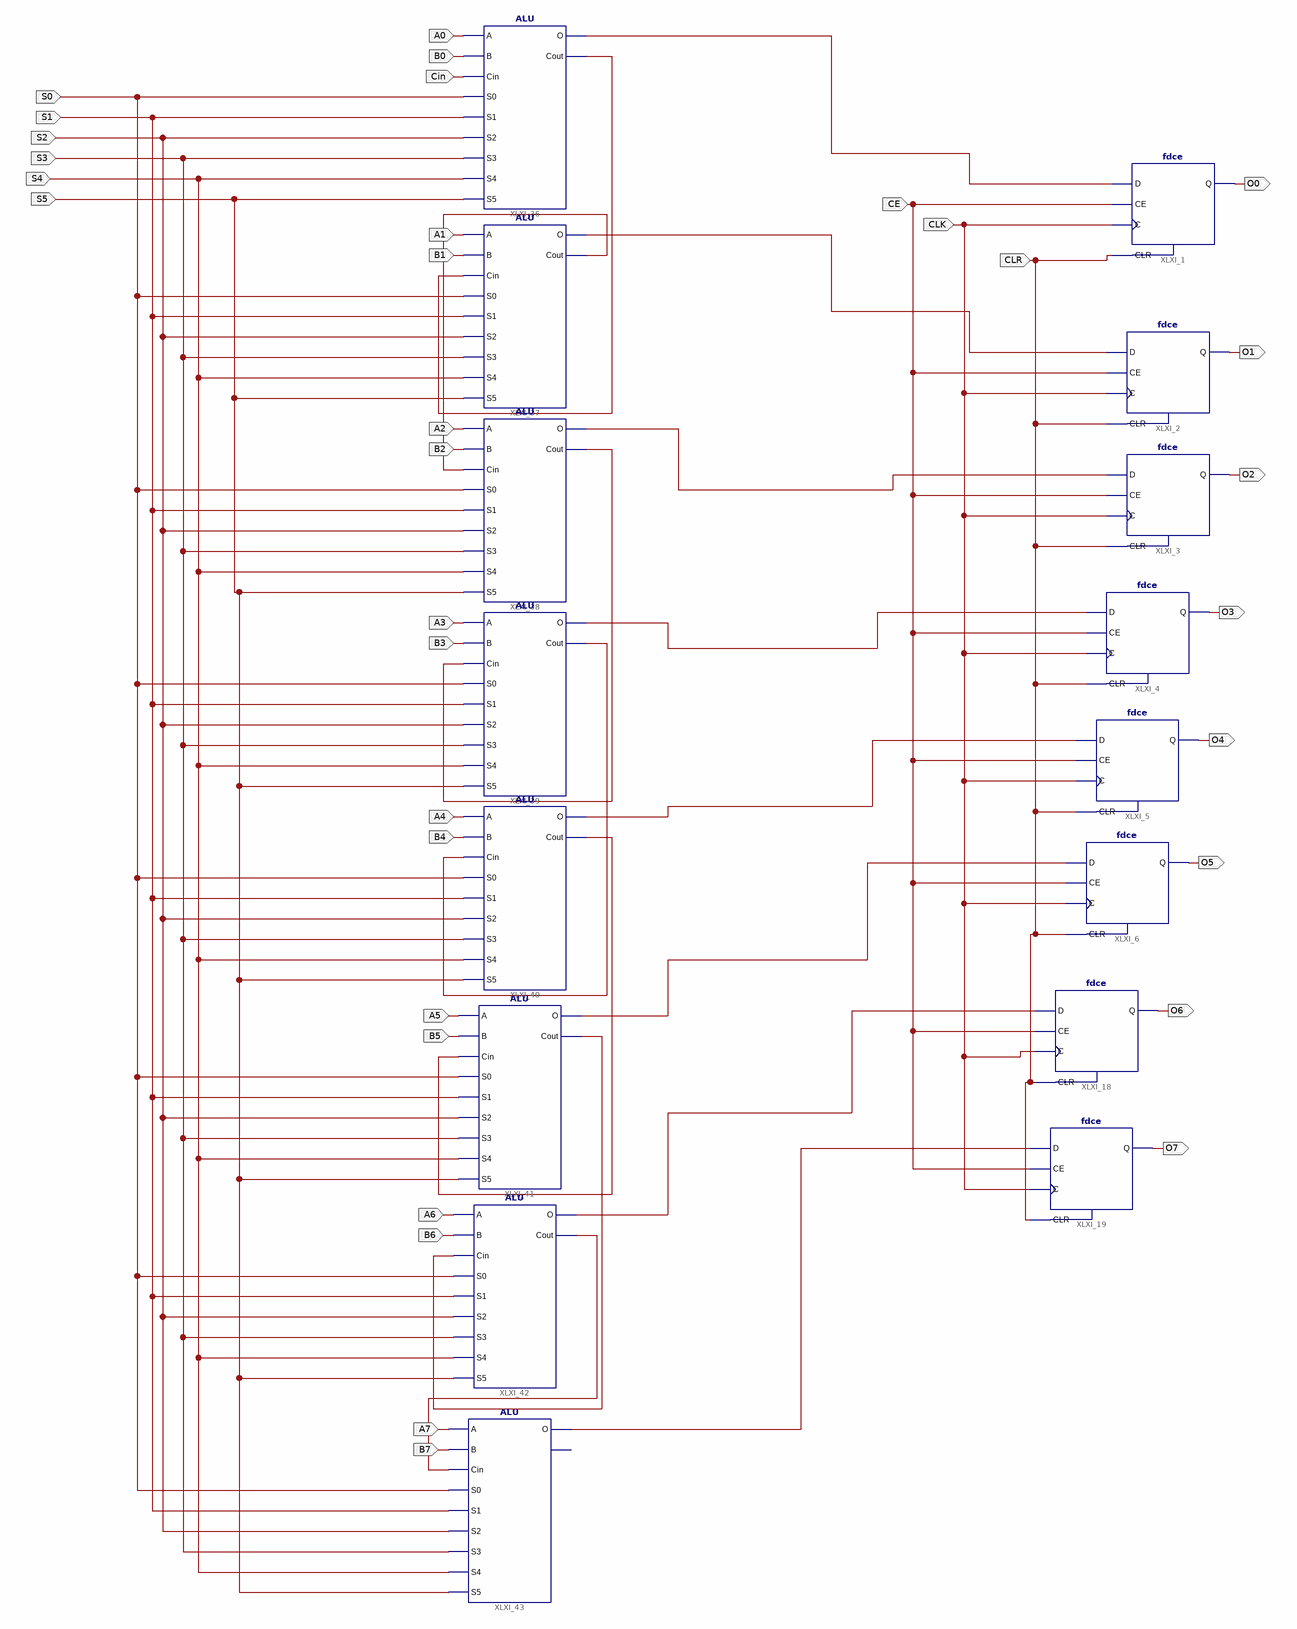
[diagram p0: schematic sheet 1]
// Xilinx ISE schematic accumulator.sch (spartan3e) as structural Verilog: 16 symbols, 34 ports
module accumulator (
  input  S0,
  input  S1,
  input  S2,
  input  S3,
  input  S4,
  input  S5,
  input  Cin,
  input  A0,
  input  B0,
  input  A1,
  input  B1,
  input  A2,
  input  B2,
  input  A3,
  input  B3,
  input  A4,
  input  B4,
  input  A5,
  input  B5,
  input  A6,
  input  B6,
  input  A7,
  input  B7,
  input  CE,
  input  CLK,
  input  CLR,
  output O0,
  output O1,
  output O2,
  output O3,
  output O4,
  output O5,
  output O6,
  output O7
);

  wire XLXN_1, XLXN_2, XLXN_3, XLXN_4, XLXN_5, XLXN_6, XLXN_7, XLXN_49, XLXN_50, XLXN_51, XLXN_52, XLXN_53,
       XLXN_54, XLXN_55, XLXN_56;

  fdce XLXI_2 (.C(CLK), .CE(CE), .CLR(CLR), .D(XLXN_2), .Q(O1));
  fdce XLXI_3 (.C(CLK), .CE(CE), .CLR(CLR), .D(XLXN_3), .Q(O2));
  fdce XLXI_4 (.C(CLK), .CE(CE), .CLR(CLR), .D(XLXN_4), .Q(O3));
  fdce XLXI_5 (.C(CLK), .CE(CE), .CLR(CLR), .D(XLXN_5), .Q(O4));
  fdce XLXI_6 (.C(CLK), .CE(CE), .CLR(CLR), .D(XLXN_6), .Q(O5));
  fdce XLXI_1 (.C(CLK), .CE(CE), .CLR(CLR), .D(XLXN_1), .Q(O0));
  fdce XLXI_18 (.C(CLK), .CE(CE), .CLR(CLR), .D(XLXN_7), .Q(O6));
  fdce XLXI_19 (.C(CLK), .CE(CE), .CLR(CLR), .D(XLXN_49), .Q(O7));
  ALU XLXI_36 (
    .A(A0), .B(B0), .Cin(Cin), .Cout(XLXN_50), .O(XLXN_1), .S0(S0), .S1(S1), .S2(S2), .S3(S3), .S4(S4),
    .S5(S5));
  ALU XLXI_37 (
    .A(A1), .B(B1), .Cin(XLXN_50), .Cout(XLXN_51), .O(XLXN_2), .S0(S0), .S1(S1), .S2(S2), .S3(S3), .S4(S4),
    .S5(S5));
  ALU XLXI_38 (
    .A(A2), .B(B2), .Cin(XLXN_51), .Cout(XLXN_52), .O(XLXN_3), .S0(S0), .S1(S1), .S2(S2), .S3(S3), .S4(S4),
    .S5(S5));
  ALU XLXI_39 (
    .A(A3), .B(B3), .Cin(XLXN_52), .Cout(XLXN_53), .O(XLXN_4), .S0(S0), .S1(S1), .S2(S2), .S3(S3), .S4(S4),
    .S5(S5));
  ALU XLXI_40 (
    .A(A4), .B(B4), .Cin(XLXN_53), .Cout(XLXN_54), .O(XLXN_5), .S0(S0), .S1(S1), .S2(S2), .S3(S3), .S4(S4),
    .S5(S5));
  ALU XLXI_41 (
    .A(A5), .B(B5), .Cin(XLXN_54), .Cout(XLXN_55), .O(XLXN_6), .S0(S0), .S1(S1), .S2(S2), .S3(S3), .S4(S4),
    .S5(S5));
  ALU XLXI_42 (
    .A(A6), .B(B6), .Cin(XLXN_55), .Cout(XLXN_56), .O(XLXN_7), .S0(S0), .S1(S1), .S2(S2), .S3(S3), .S4(S4),
    .S5(S5));
  ALU XLXI_43 (
    .A(A7), .B(B7), .Cin(XLXN_56), .O(XLXN_49), .S0(S0), .S1(S1), .S2(S2), .S3(S3), .S4(S4), .S5(S5));  // open: Cout
endmodule
